# Altium schematic sheet PM.SchDoc: CATS Telemetry
size A4; Author: Luca Jost; Revision: 1.0; SheetNumber: 3; SheetTotal: 7; Subtitle: Power Management
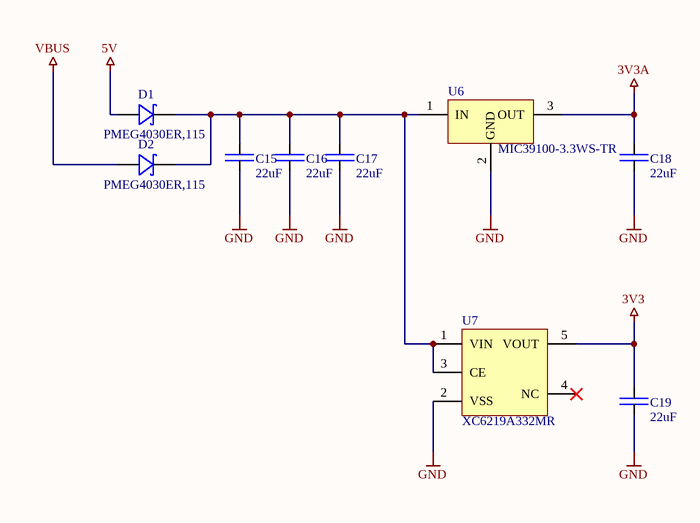
[diagram p0: PM.SchDoc]

## Parts
C15  22uF  [SMD Keramikkondensator 0805]
C16  22uF  [SMD Keramikkondensator 0805]
C17  22uF  [SMD Keramikkondensator 0805]
C18  22uF  [SMD Keramikkondensator 0805]
C19  22uF  [SMD Keramikkondensator 0805]
D1  PMEG4030ER,115  [SMD Diode SOD-123]
D2  PMEG4030ER,115  [SMD Diode SOD-123]
U6  MIC39100-3.3WS-TR  [SMD IC SOT-223-3]
U7  XC6219A332MR  [SMD IC SOT-23-5]

## Nets
3V3: C19.2 U7.5(VOUT)
3V3A: C18.2 U6.3(OUT)
5V: D1.A
GND: C15.1 C16.1 C17.1 C18.1 C19.1 U6.2(GND) U7.2(VSS)
VBUS: D2.A
NetC15_2: C15.2 C16.2 C17.2 D1.K D2.K U6.1(IN) U7.1(VIN) U7.3(CE)

Not connected (* = marked no-connect by the designer): U7 4(NC)*

## Notes on the sheet
- Title
- Author:
- Subtitle
- Date:
- Rev:
- CATS
- Sheet
- of
- File:

## Library data of the parts
C15-C19 = E6 - 22uF: SMD Ceramic Capacitor E6; Unit Price: 0.01; Number: -; Supplier: -
D1 D2 = PMEG4030ER,115: Diode Schottky 3A Surface Mount CFP3; Digikey: 1727-5313-2-ND
U6 = MIC39100-3.3WS-TR: Linear Voltage Regulator IC Positive Fixed 1 Output 1A SOT-223-3; ComponentLink1Description: Datasheet; ComponentLink1URL: https://ww1.microchip.com/downloads/en/DeviceDoc/20005834A.pdf; Digikey: MIC39100-3.3WS-TR-ND
U7 = XC6219A332MR: 300mA High Speed LDO Regulators with ON/OFF Switch; Digikey: 893-1167-1-ND; ComponentLink1Description: Datasheet; ComponentLink1URL: https://datasheet.lcsc.com/szlcsc/1809201520_Torex-Semicon-XC6219A332MR_C58229.pdf